# EAGLE schematic programmer shield (EAGLE 7.3.0)
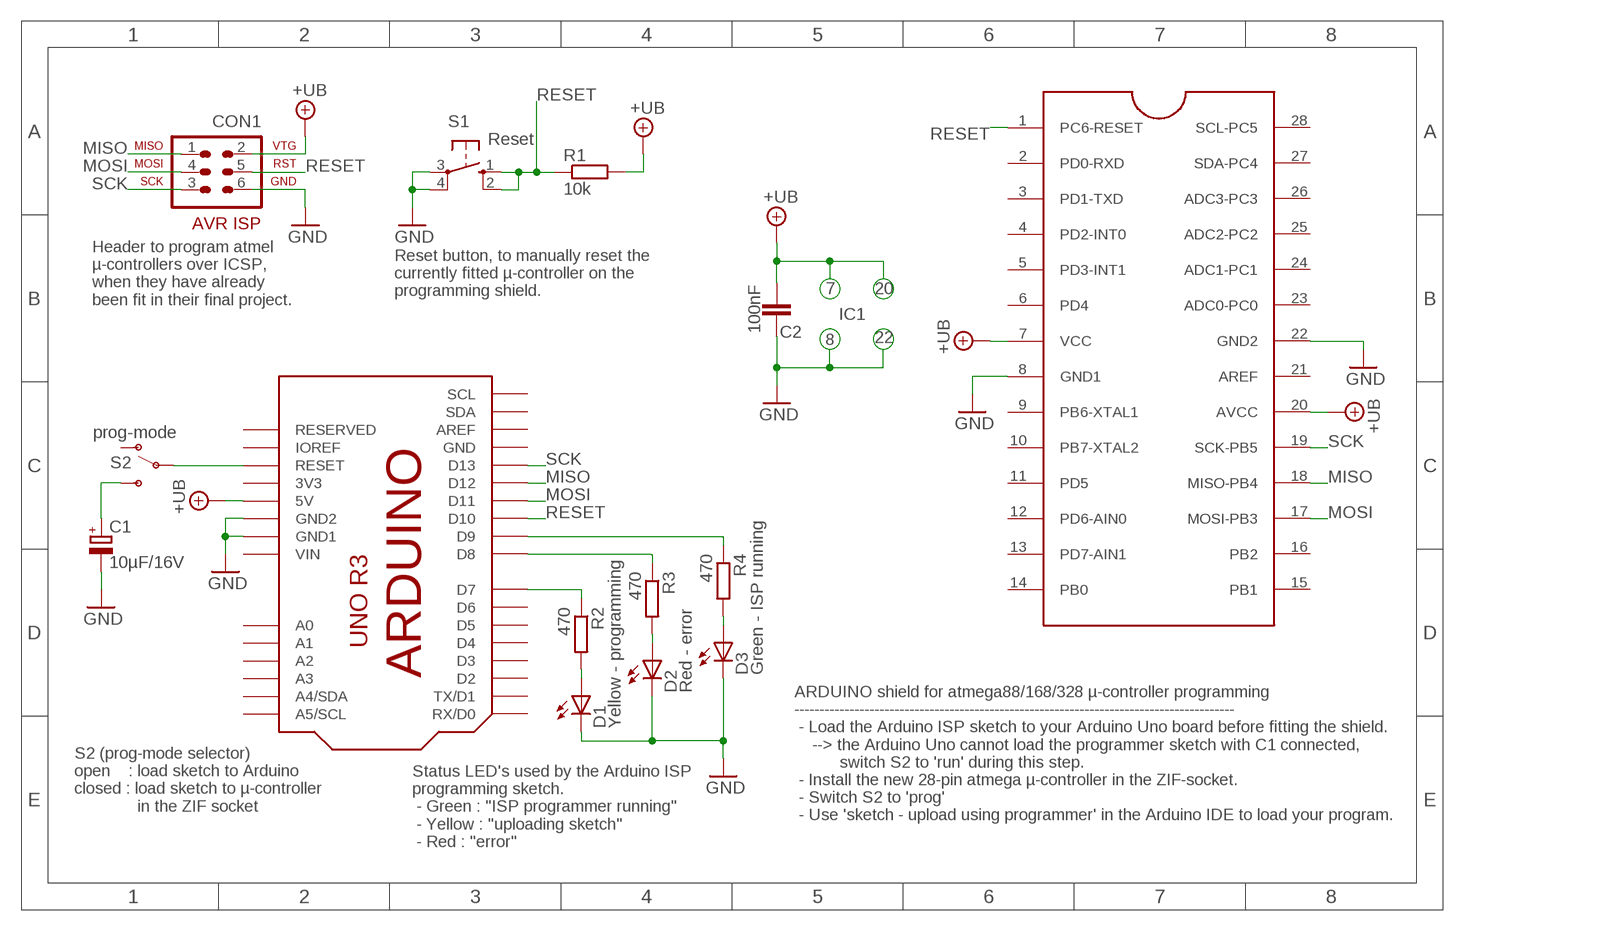
[diagram p0: schematic, sheet 1]

## Parts
C1  10µF/16V  CPOL-EUE2,5-6E  [E2,5-6E]
C2  100nF  C-EU050-025X075  [C050-025X075]
CON1  ICSP  AVR-ISP-6  [AVR-ISP-6]
D1  Yellow - programming  LED3MM  [LED3MM]
D2  Red - error  LED3MM  [LED3MM]
D3  Green - ISP running  LED3MM  [LED3MM]
IC1  Atmega88/168/328  ZIFSOCKET-28-3"  [DIL28-3-ZIF_NARROW]
R1  10k  R-EU_0207/7  [0207/7]
R2  470  R-EU_0204/5  [0204/5]
R3  470  R-EU_0204/5  [0204/5]
R4  470  R-EU_0204/5  [0204/5]
S1  Reset  10-XX  [B3F-10XX]
S2  prog-mode  SWITCH-SPDT_9.0X4.0MM  [MINI_SPDT_SWITCH-9.0X4.0MM]
U$1  Arduino Uno  ARDUINO-UNO_R3  [ARDUINO-R3]

## Nets
+UB: C2.2 CON1.2 IC1.7(VCC) IC1.20(AVCC) R1.2 U$1.5V
GND: C1.- C2.1 CON1.6 D1.K(C) D2.K(C) D3.K(C) IC1.8(GND1) IC1.22(GND2) S1.3(P) S1.4(P1) U$1.GND1 U$1.GND2
MISO: CON1.1 IC1.18(MISO-PB4) U$1.D12
MOSI: CON1.4 IC1.17(MOSI-PB3) U$1.D11
N$1: C1.+ S2.3(S)
N$2: R4.1 U$1.D9
N$3: R2.1 U$1.D7
N$4: R3.1 U$1.D8
N$5: D1.A R2.2
N$6: D2.A R3.2
N$7: D3.A R4.2
N$19: S2.2(P) U$1.RESET
RESET: CON1.5 IC1.1(PC6-RESET) R1.1 S1.1(S) S1.2(S1) U$1.D10
SCK: CON1.3 IC1.19(SCK-PB5) U$1.D13
Unconnected: IC1.2(PD0-RXD) IC1.3(PD1-TXD) IC1.4(PD2-INT0) IC1.5(PD3-INT1) IC1.6(PD4) IC1.9(PB6-XTAL1) IC1.10(PB7-XTAL2) IC1.11(PD5) IC1.12(PD6-AIN0) IC1.13(PD7-AIN1) IC1.14(PB0) IC1.15(PB1) IC1.16(PB2) IC1.21(AREF) IC1.23(ADC0-PC0) IC1.24(ADC1-PC1) IC1.25(ADC2-PC2) IC1.26(ADC3-PC3) IC1.27(SDA-PC4) IC1.28(SCL-PC5) S2.1(O) U$1.A0 U$1.A1 U$1.A2 U$1.A3 U$1.A4(A4/SDA) U$1.A5(A5/SCL) U$1.AREF U$1.D0(RX/D0) U$1.D1(TX/D1) U$1.D2 U$1.D3 U$1.D4 U$1.D5 U$1.D6 U$1.IOREF U$1.RESERVED U$1.SCL U$1.SDA

## Notes on the sheet
- 7 | 20
- Reset button, to manually reset the
  currently fitted µ-controller on the
  programming shield.
- Header to program atmel 
  µ-controllers over ICSP,
  when they have already
  been fit in their final project.
- IC1
- 8 | 22
- S2 (prog-mode selector)
  open    : load sketch to Arduino
  closed : load sketch to µ-controller 
                in the ZIF socket
- ARDUINO shield for atmega88/168/328 µ-controller programming
  ----------------------------------------------------------------------------------------
   - Load the Arduino ISP sketch to your Arduino Uno board before fitting the shield.
      --> the Arduino Uno cannot load the programmer sketch with C1 connected,
            switch S2 to 'run' during this step.
   - Install the new 28-pin atmega µ-controller in the ZIF-socket.
   - Switch S2 to 'prog'
   - Use 'sketch - upload using programmer' in the Arduino IDE to load your program.
- Status LED's used by the Arduino ISP 
  programming sketch.
   - Green : "ISP programmer running"
   - Yellow : "uploading sketch"
   - Red : "error"

## Power pins joined to a net without a drawn wire
3V3: U$1.3V(3V3)
GND: U$1.GND
VIN: U$1.VIN

## Library data of the parts
C1 = rcl:CPOL-EU: POLARIZED CAPACITOR, European symbol
C2 = rcl:C-EU: CAPACITOR, European symbol
CON1 = avr-4:AVR-ISP-6: AVR ISP-6 Serial Programming Header
D1-D3 = led:LED: LED OSRAM: - CHIPLED LG R971, LG N971, LY N971, LG Q971, LY Q971, LO R971, LY R971 LH N974, LH R974 LS Q976, LO Q976, LY Q976 LO Q996 - Hyper CHIPLED LW Q18S LB Q993, LB Q99A, LB R99A - SideLED LS A670, LO A670, LY A670, LG A670, LP A670 LB A673, LV A673, LT A673, LW A673 LH A674 LY A675 LS A676, LA A676, LO A676, LY A676, LW A676 LS A679, LY A679, LG A679 - Hyper Micro SIDELED® LS Y876, LA Y876, LO Y876, LY Y876 LT Y87S - SmartLED LW L88C, LW L88S LB L89C, LB L89S, LG L890 LS L89K, LO L89K, LY L89K LS L896, LA L896, LO L896, LY L896 - TOPLED LS T670, LO T670, LY T670, LG T670, LP T670 LSG T670, LSP T670, LSY T670, LOP T670, LYG T670 LG T671, LOG T671, LSG T671 LB T673, LV T673, LT T673, LW T673 LH T674 LS T676, LA T676, LO T676, LY T676, LB T676, LH T676, LSB T676, LW T676 LB T67C, LV T67C, LT T67C, LS T67K, LO T67K, LY T67K, LW E67C LS E67B, LA E67B, LO E67B, LY E67B, LB E67C, LV E67C, LT E67C LW T67C LS T679, LY T679, LG T679 LS T770, LO T770, LY T770, LG T770, LP T770 LB T773, LV T773, LT T773, LW T773 LH T774 LS E675, LA E675, LY E675, LS T675 LS T776, LA T776, LO T776, LY T776, LB T776 LHGB T686 LT T68C, LB T68C - Hyper Mini TOPLED® LB M676 - Mini TOPLED Santana® LG M470 LS M47K, LO M47K, LY M47K Source: http://www.osram.convergy.de LUXEON: - LUMILED® LXK2-PW12-R00, LXK2-PW12-S00, LXK2-PW14-U00, LXK2-PW14-V00 LXK2-PM12-R00, LXK2-PM12-S00, LXK2-PM14-U00 LXK2-PE12-Q00, LXK2-PE12-R00, LXK2-PE12-S00, LXK2-PE14-T00, LXK2-PE14-U00 LXK2-PB12-K00, LXK2-PB12-L00, LXK2-PB12-M00, LXK2-PB14-N00, LXK2-PB14-P00, LXK2-PB14-Q00 LXK2-PR12-L00, LXK2-PR12-M00, LXK2-PR14-Q00, LXK2-PR14-R00 LXK2-PD12-Q00, LXK2-PD12-R00, LXK2-PD12-S00 LXK2-PH12-R00, LXK2-PH12-S00 LXK2-PL12-P00, LXK2-PL12-Q00, LXK2-PL12-R00 Source: www.luxeon.com KINGBRIGHT: KA-3528ASYC Source: www.kingbright.com
IC1 = ccr-lib:ZIFSOCKET-28-3: ZIF Socket 28-Pin 0.3" Lever-action ZIF socket for 28-pin ICs
R1-R4 = resistor:R-EU_: RESISTOR, European symbol
S1 = switch-omron:10-XX: OMRON SWITCH; MPN: B3F-1000; OC_FARNELL: 176432; OC_NEWARK: 36M3542
S2 = ccr-lib:SWITCH-SPDT: Single-Pole, Double-Throw (SPDT) mini Switch
U$1 = ccr-lib:ARDUINO-UNO: Arduino R3 with extra pins : - IOref pin - reserved pin - duplicated I2C, A4/A5 pins